# EAGLE design PCB_eLock_G592_J1_only_actuators (EAGLE 6.6.0)
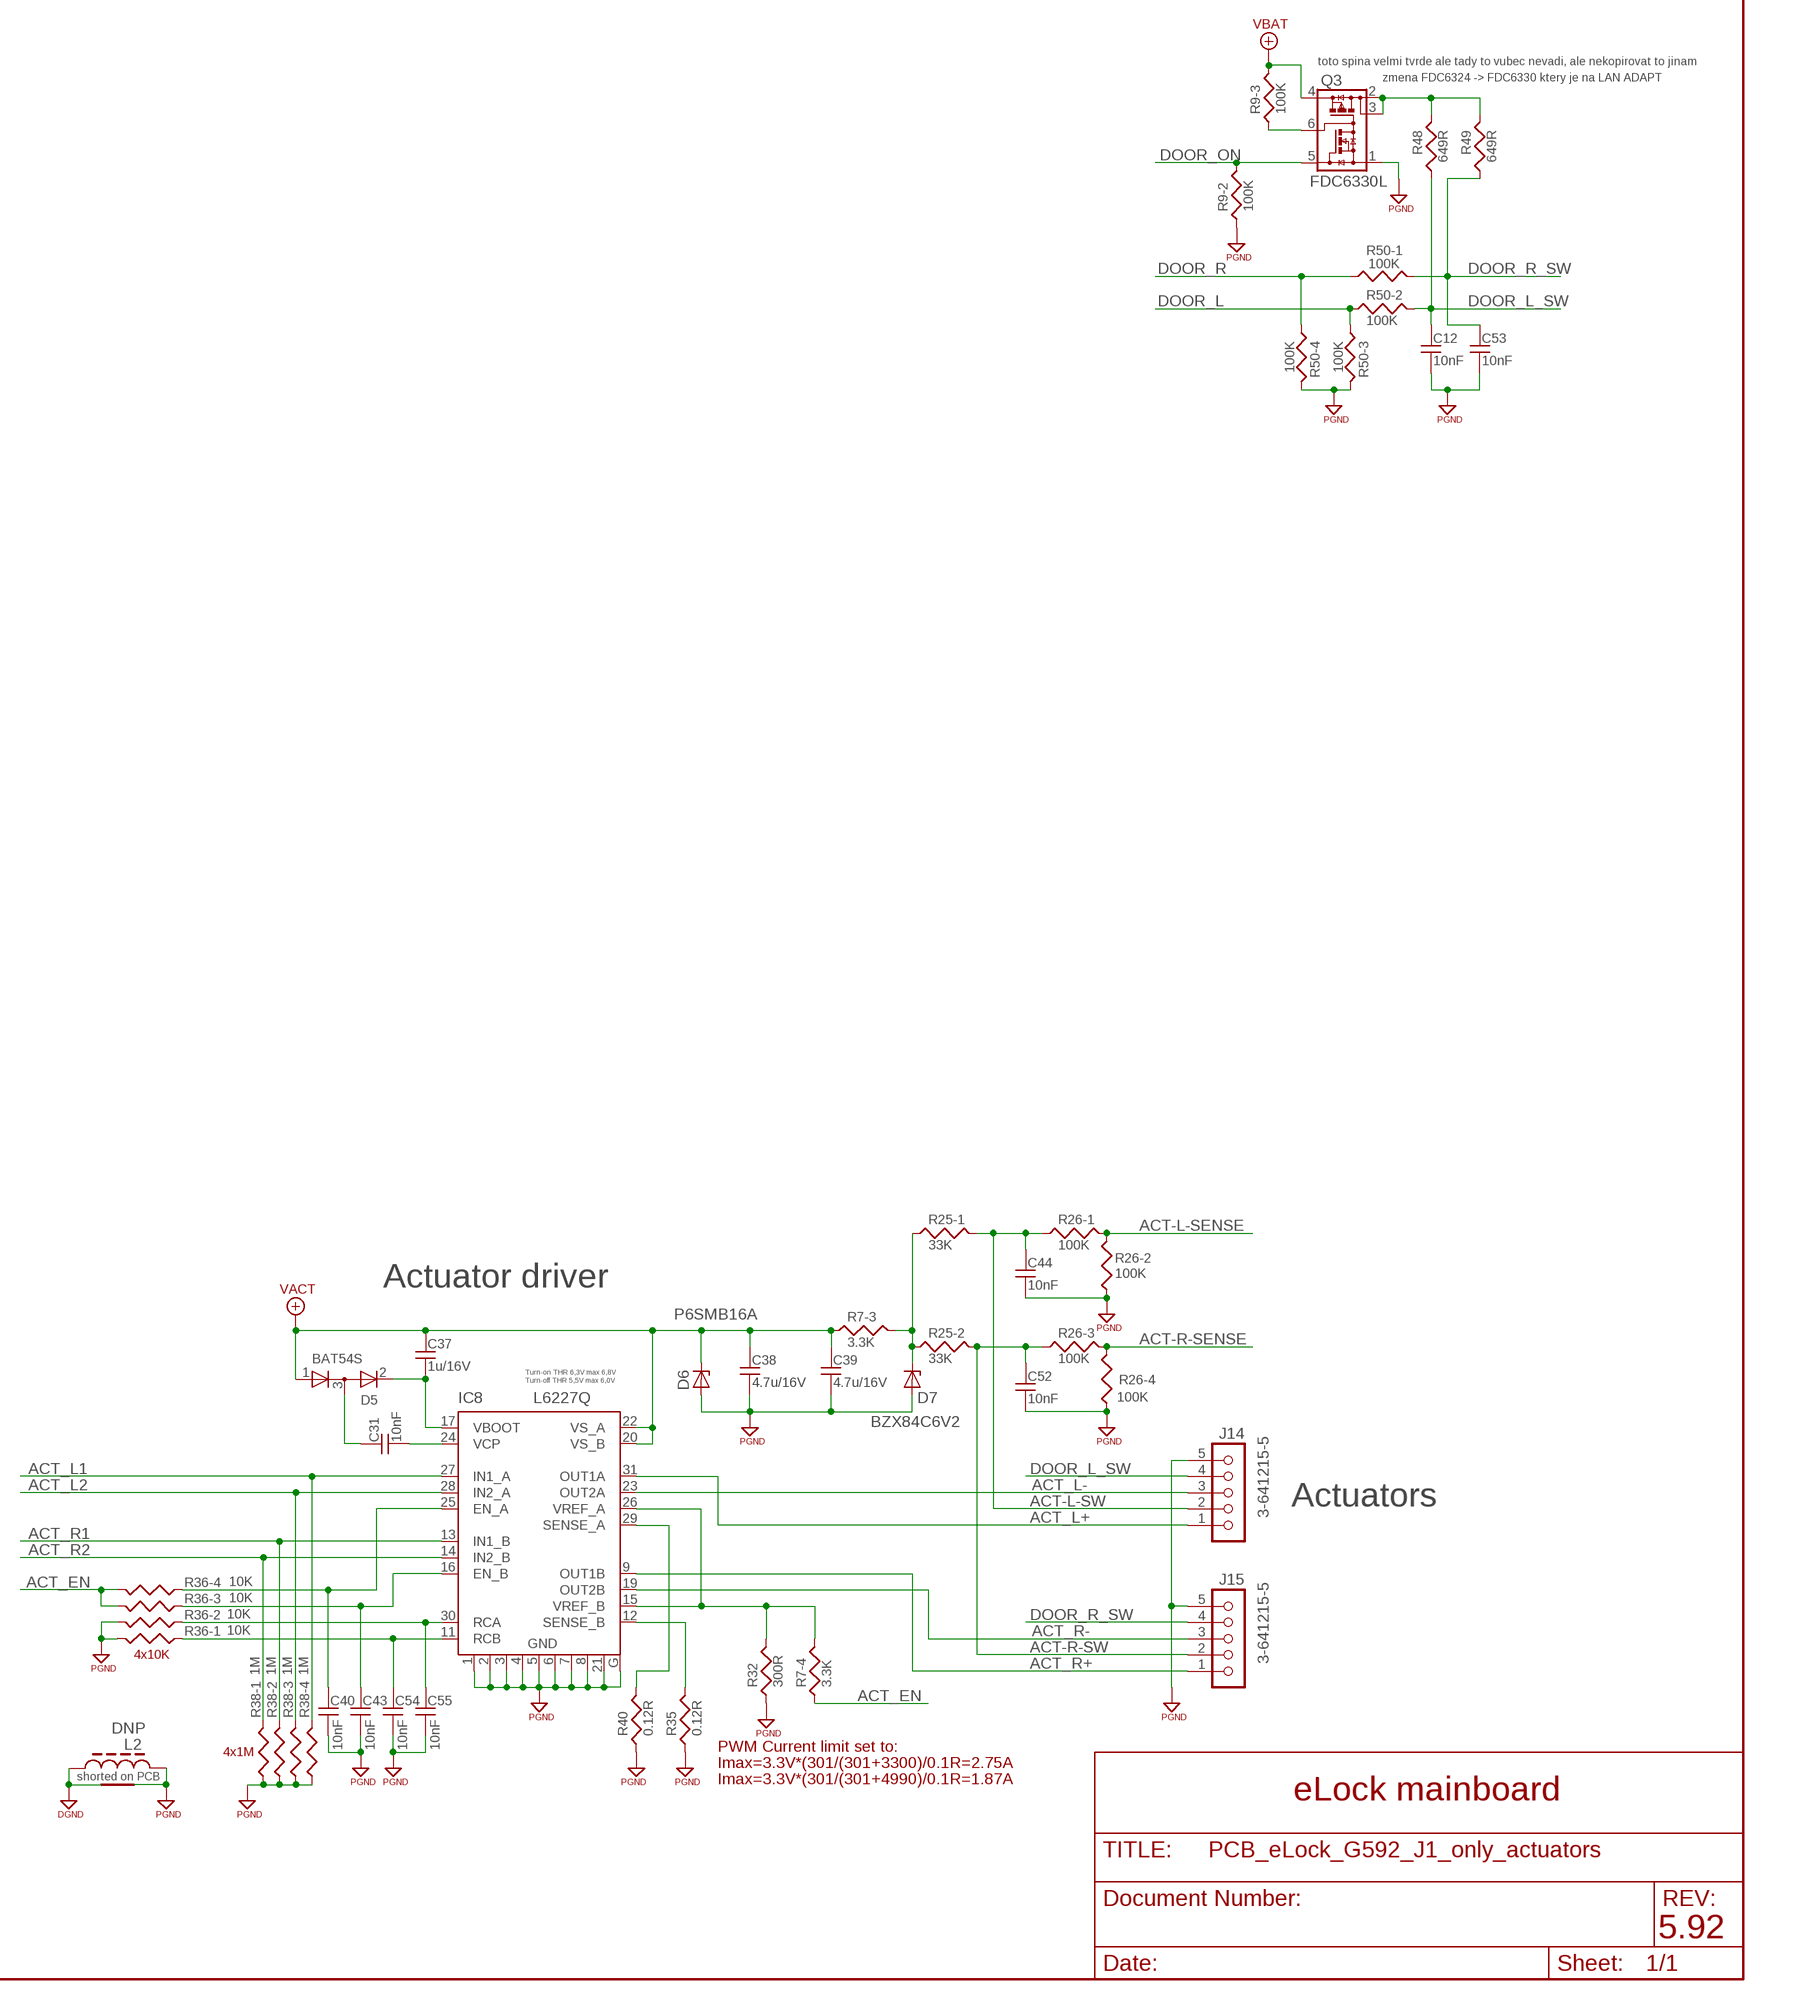
[diagram p0: schematic, sheet 1]

## Parts
C12  10nF  C-0603  [0603]
C31  10nF  C-0603  [0603]
C37  1u/16V  C-0603  [0603]
C38  4.7u/16V  C-0805  [0805]
C39  4.7u/16V  C-0805  [0805]
C40  10nF  C-0603  [0603]
C43  10nF  C-0603  [0603]
C44  10nF  C-0603  [0603]
C52  10nF  C-0603  [0603]
C53  10nF  C-0603  [0603]
C54  10nF  C-0603  [0603]
C55  10nF  C-0603  [0603]
D5  BAT54S  [SOT-23]
D6  P6SMB16A  [SMB]
D7  BZX84C6V2  [SOT-23]
IC8  L6227Q  [SQFP-S-5X5-32]
J14  3-641215-5  [3-641215-5]
J15  3-641215-5  [3-641215-5]
L2  DNP  L-0805-0R  [0805-0RTOP]
Q3  FDC6330L  FDC6324L  [SSOT-6]
R7  3.3K  EXB-38  [0603-ARRAY]
R9  100K  EXB-38  [0603-ARRAY]
R25  33K  EXB-38  [0603-ARRAY]
R26  100K  EXB-38  [0603-ARRAY]
R32  300R  R-0603  [0603]
R35  0.12R  R-0805  [0805]
R36  10K  EXB-38  [0603-ARRAY]
R38  1M  EXB-38  [0603-ARRAY]
R40  0.12R  R-0805  [0805]
R48  649R  R-0603  [0603]
R49  649R  R-0603  [0603]
R50  100K  EXB-38  [0603-ARRAY]

## Nets
ACT-L-SENSE: R26.7 R26.8
ACT-L-SW: C44.1 J14.2 R25.8 R26.1
ACT-R-SENSE: R26.5 R26.6
ACT-R-SW: C52.1 J15.2 R25.7 R26.3
ACT_EN: R7.4 R36.5 R36.6
ACT_L1: IC8.27(IN1_A) R38.5
ACT_L2: IC8.28(IN2_A) R38.6
ACT_L+: IC8.31(OUT1A) J14.1
ACT_L-: IC8.23(OUT2A) J14.3
ACT_R1: IC8.13(IN1_B) R38.7
ACT_R2: IC8.14(IN2_B) R38.8
ACT_R+: IC8.9(OUT1B) J15.1
ACT_R-: IC8.19(OUT2B) J15.3
DGND: L2.2
DOOR_L: R50.2 R50.3
DOOR_L_SW: C12.1 J14.4 R48.2 R50.7
DOOR_ON: Q3.5(Q1G) R9.7
DOOR_R: R50.1 R50.4
DOOR_R_SW: C53.1 J15.4 R49.2 R50.8
N$6: C31.2 IC8.24(VCP)
N$19: C31.1 D5.3(KA)
N$29: D7.3(C) R7.6 R25.1 R25.2
N$31: IC8.12(SENSE_B) R35.2
N$35: Q3.6(Q2G) R9.3
N$40: Q3.2(Q2D1) Q3.3(Q2D2) R48.1 R49.1
N$41: IC8.29(SENSE_A) R40.2
N$47: C37.2 D5.2(K) IC8.17(VBOOT)
N$51: C54.1 IC8.11(RCB) R36.1
N$60: C40.1 IC8.25(EN_A) R36.4
N$70: C43.1 IC8.16(EN_B) R36.3
N$71: C55.1 IC8.30(RCA) R36.2
N$78: IC8.15(VREF_B) IC8.26(VREF_A) R7.5 R32.2
PGND: C12.2 C38.2 C39.2 C40.2 C43.2 C44.2 C52.2 C53.2 C54.2 C55.2 D6.A D7.1(A) IC8.1(GND1) IC8.2(GND2) IC8.3(GND3) IC8.4(GND4) IC8.5(GND5) IC8.6(GND6) IC8.7(GND7) IC8.8(GND8) IC8.21(GND21) IC8.G(GNEXP) J14.5 J15.5 L2.1 Q3.1(Q1S) R9.2 R26.2 R26.4 R32.1 R35.1 R36.7 R36.8 R38.1 R38.2 R38.3 R38.4 R40.1 R50.5 R50.6
VACT: C37.1 C38.1 C39.1 D5.1(A) D6.C IC8.20(VS_B) IC8.22(VS_A) R7.3
VBAT: Q3.4(Q2S) R9.6
Unconnected: R7.1 R7.2 R7.7 R7.8 R9.1 R9.4 R9.5 R9.8 R25.3 R25.4 R25.5 R25.6

## Notes on the sheet
- toto spina velmi tvrde ale tady to vubec nevadi, ale nekopirovat to jinam
- zmena FDC6324 -> FDC6330 ktery je na LAN ADAPT
- Actuator driver
- Turn-on THR 6,3V max 6,8V
- Turn-off THR 5,5V max 6,0V
- Actuators
- 4x10K
- PWM Current limit set to:
- 4x1M
- Imax=3.3V*(301/(301+3300)/0.1R=2.75A
- shorted on PCB
- Imax=3.3V*(301/(301+4990)/0.1R=1.87A
- eLock mainboard
- 5.92

## Library data of the parts
C12 C31 C37 C40 C43 C44 C52-C55 = DISCRETE:C-0603
C38 C39 = DISCRETE:C-0805
D5 = Fairchild-AON:BAT54S: Schottky diode dual 30V 200mA
D6 = Littelfuse:P6SMB*: TVS Unidirectional 13.6V, 15.2-16.8V breakdown
D7 = Fairchild-AON:BZX84C: Diode Zener SOT23
IC8 = st-microelectronics-AOM:L6227: DMOS dual full bridge driver with PWM 2A, 0.7Ohm 52V
J14 J15 = Tyco-U:3-641215-5: Connector 5 pin 100 mil
L2 = DISCRETE:L-0805-0R
Q3 = Fairchild-AON:FDC6324: IC LOAD SWITCH INT 20VIN SSOT-6
R7 R9 R25 R26 R36 R38 R50 = Panasonic-AON:EXB-38: Resistor array 4x
R32 R48 R49 = DISCRETE:R-0603
R35 R40 = DISCRETE:R-0805

## Board
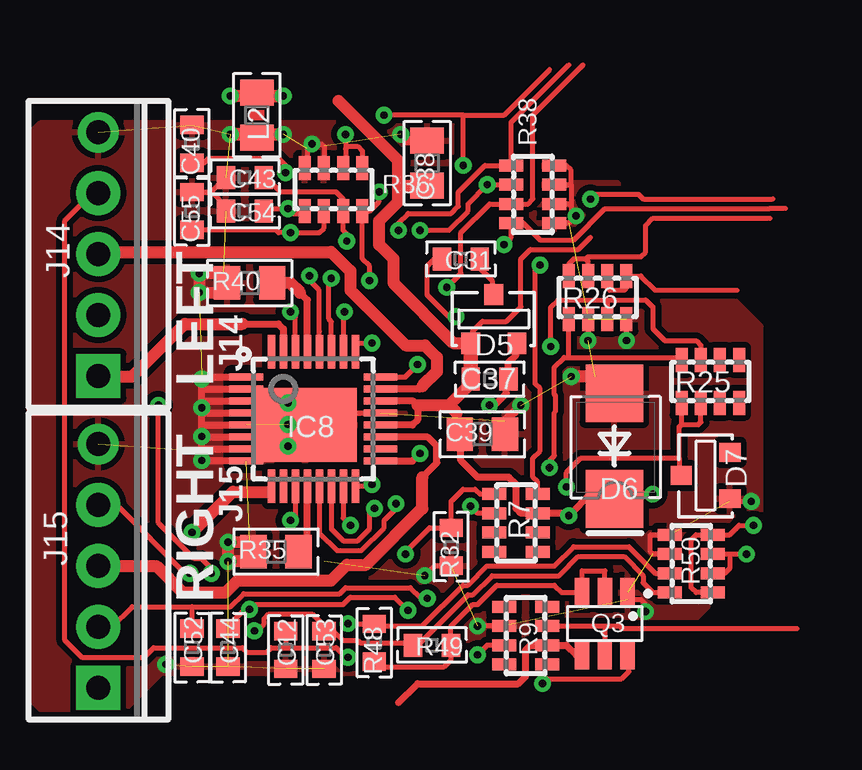
[diagram p1: board, top side]
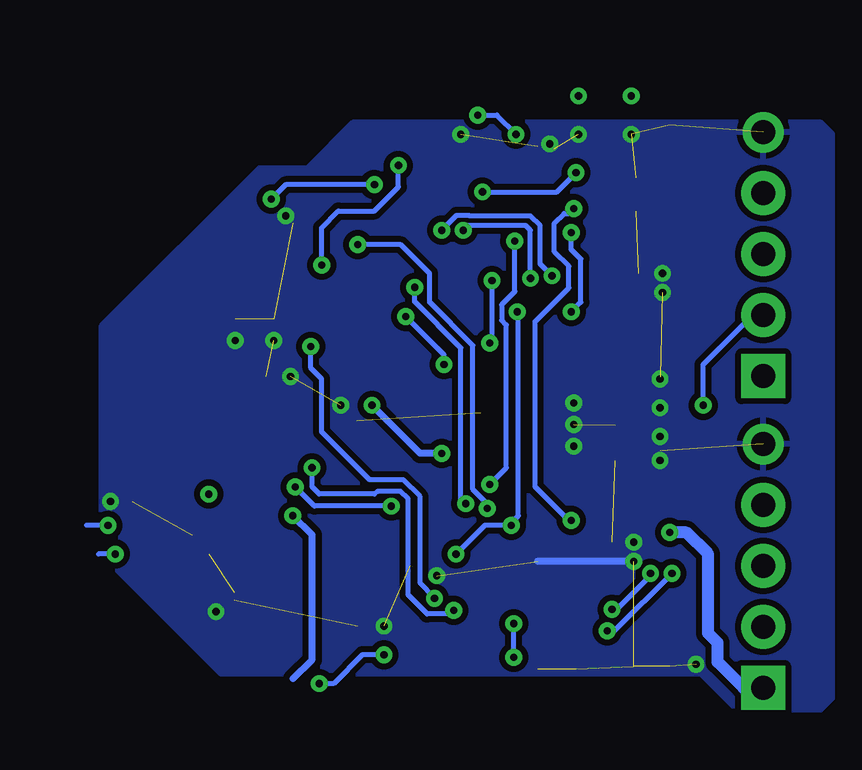
[diagram p2: board, bottom side, seen from below]

No outline drawn. Coordinates in mm, seen from the top.
Copper layers (1+16): Top 0.035mm / dielectric 1.5mm / Bottom 0.035mm
Design rules "default": minimum track width 0.2mm, minimum drill 0.3mm, track to track 0.153mm, track to pad 0.15mm, pad to pad 0.162mm, via to via 0.15mm, smd to smd 0.15mm, copper to edge 5mil, drill to drill 8mil, minimum pad ring 0.2mm, minimum via ring 0.2mm, stop-mask expansion 4mil, vias tented up to drill 0.3mm, thermal gap 10mil
tRestrict: area 10.4,34.6 to 14.2,35.1

### Footprints (pad centres in the part's own frame; a part is rotated, then mirrored left to right if it is on the bottom)
0603 = smd 0.762 x 0.965: 1 -0.787,0; 2 0.787,0
0805 = smd 1.092 x 1.397: 1 -0.94,0; 2 0.94,0
SOT-23 = smd 0.787 x 0.889: 1 0.991,1.016; 2 -0.94,1.016; 3 0.025,-1.016
SMB = smd 2.4 x 2.4: A 2.2,0; C -2.2,0
SQFP-S-5X5-32 = smd 0.3 x 1.4: 1 -1.75,-2.8; 2 -1.25,-2.8; 3 -0.75,-2.8; 4 -0.25,-2.8; 5 0.25,-2.8; 6 0.75,-2.8; 7 1.25,-2.8; 8 1.75,-2.8; 17 1.75,2.8; 18 1.25,2.8; 19 0.75,2.8; 20 0.25,2.8; 21 -0.25,2.8; 22 -0.75,2.8; 23 -1.25,2.8; 24 -1.75,2.8 | smd 1.4 x 0.3: 9 2.8,-1.75; 10 2.8,-1.25; 11 2.8,-0.75; 12 2.8,-0.25; 13 2.8,0.25; 14 2.8,0.75; 15 2.8,1.25; 16 2.8,1.75; 25 -2.8,1.75; 26 -2.8,1.25; 27 -2.8,0.75; 28 -2.8,0.25; 29 -2.8,-0.25; 30 -2.8,-0.75; 31 -2.8,-1.25; 32 -2.8,-1.75 | smd 3.1 x 4.3: G 0.25,-0.35
3-641215-5 = drill 1 pad 1.829 square: 1 5.08,0 | drill 1 pad 1.829: 2 2.54,0; 3 0,0; 4 -2.54,0 | drill 1 pad 1.702: 5 -5.08,0
0805-0RTOP = smd 1.092 x 1.397: 1 -0.94,0; 2 0.94,0
SSOT-6 = smd 0.6 x 1.2: 1 -0.95,-1.306; 2 0,-1.306; 3 0.95,-1.306; 4 0.95,1.306; 5 0.003,1.306; 6 -0.95,1.306
0603-ARRAY = smd 0.5 x 1: 1 -1.2,-0.9; 2 -0.4,-0.9; 3 0.4,-0.9; 4 1.2,-0.9; 5 1.2,0.9; 6 0.4,0.9; 7 -0.4,0.9; 8 -1.2,0.9

### Placement (x,y rotation side)
C12  11.2,23.5 270 top
C31  18.5,39.8 180 top
C37  19.7,34.8 0 top
C38  17.1,43.8 90 top
C39  19.4,32.5 0 top
C40  7.3,44.6 90 top
C43  9.5,43.2 180 top
C44  8.8,23.6 270 top
C52  7.3,23.6 270 top
C53  12.8,23.5 270 top
C54  9.5,41.8 180 top
C55  7.3,41.8 90 top
D5  19.9,37.3 180 top
D6  24.9,32 90 top
D7  28.7,30.8 270 top
IC8  12.36,33.13 270 top
J14  3.4,40 270 top
J15  3.4,27 270 top
L2  10,45.8 90 top
Q3  24.5,24.6 180 top
R7  20.8,28.8 90 top
R9  21.2,24.1 270 top
R25  28.9,34.7 0 top
R26  24.2,38.2 0 top
R32  18.1,27.8 90 top
R35  10.8,27.6 0 top
R36  13.2,42.7 0 top
R38  21.5,42.5 90 top
R40  9.7,38.8 0 top
R48  14.9,23.8 90 top
R49  17.3,23.7 180 top
R50  28.1,27.1 90 top

### Tracks (layer width: path | path; a pad name or v marks a point on that pad's centre or on a via)
ACT-L-SENSE
  Top 0.2: R26.8 23,39.6 23.2,39.8 23.7,39.8 | 23.7,39.8 23.8,39.9 26,39.9 26.2,40.1 26.2,41.2 26.5,41.5 31.38,41.5 | R26.7 23.8,39.7 23.7,39.8
ACT-L-SW  (via drill 0.3 pad 0.7)
  Top 0.2: v5.9,33.7 5.9,28.8 7.4,27.3 7.7,27.3 8.1,26.9 v8.1,26.7 | R25.8 27.6,35.7 23,35.7 | 23,35.7 R26.1 | 23,35.7 22.8,35.7 22.4,35.3 22.4,34.15 22.45,34.1 22.45,33.45 22.4,33.4 22.4,31.6 22.2,31.4 v22.2,31.1 | v16.3,25.15 15.75,25.7 13.9,25.7 13.6,25.4 9.9,25.4 v9.7,25.2 9.5,25.2 8.8,24.5 C44.1
  Bottom 0.2: J14.2 3.84,37.46 5.9,35.4 v5.9,33.7 | v9.7,25.2 9.5,25.2 8.1,26.6 v8.1,26.7 | v22.2,31.1 22.2,30.3 21.9,30 19.6,30 19.5,30.1 19.48,30.1 19.46,30.12 18.52,30.12 18.2,29.8 18.2,25.8 17.4,25 16.45,25 v16.3,25.15
ACT-R-SENSE
  Top 0.2: R26.6 24.6,38.6 24.7,38.5 25.3,38.5 25.4,38.6 R26.5 26,39.1 26.6,38.5 30,38.5
ACT-R-SW  (via drill 0.3 pad 0.7)
  Top 0.2: J15.2 3.96,24.46 4.8,25.3 7.3,25.3 | 24.6,38.1 26.2,38.1 26.5,37.8 26.5,36.9 27,36.4 28.3,36.4 28.5,36.2 R25.7 | 24.6,38.1 R26.3 | 24.6,38.1 22.55,38.1 22.25,37.8 v22.25,36.15 | 7.3,25.3 8.9,25.3 9.45,25.85 13.45,25.85 13.7,26.1 16.4,26.1 16.8,25.7 17.05,25.7 v17.1,25.65 | C52.1 7.3,25.3
  Bottom 0.2: v22.25,36.15 22.25,35.25 21.8,34.8 21.8,32.6 19.8,30.6 18.4,30.6 17.7,29.9 17.7,26.3 17.1,25.7 v17.1,25.65
ACT_EN  (via drill 0.3 pad 0.7)
  Top 0.2: 22.2,47.7 20.3,45.8 18.6,45.8 | 18.6,45.8 v15.3,45.8 | 13.7,44.4 13.7,43.7 R36.6 | v13.7,45 13.7,44.4 | R36.5 14.4,44.3 14.2,44.5 13.8,44.5 13.7,44.4 | v21.8,39.55 21.6,39.35 21.6,34.6 21.8,34.4 21.8,31.8 21.5,31.5 21.5,30.7 21.7,30.5 R7.4 | v18.6,43.7 18.6,45.8
  Bottom 0.2: v15.3,45.8 14.5,45.8 v13.7,45 | v21.8,39.55 21.8,41.1 21.1,41.8 19.6,41.8 18.6,42.8 v18.6,43.7
ACT_L1  (via drill 0.3 pad 0.7)
  Top 0.2: IC8.27 13.11,37.19 13,37.3 13,38.9 v13.1,39 | v15.9,41 15.9,41.3 16.3,41.7 18.1,41.7 18.4,42 18.4,42.6 19.5,43.7 R38.5 20.6,45.5 23,47.9
  Bottom 0.2: v13.1,39 13.1,41 13.3,41.2 15.7,41.2 v15.9,41
ACT_L2  (via drill 0.3 pad 0.7)
  Top 0.2: IC8.28 12.61,36.79 12.6,36.8 12.6,38.5 12.2,38.9 v12.2,39.1 | v16.8,41 18,41 18.8,41.8 18.8,42.1 v19.6,42.9 R38.6 | 31.5,42.3 26.1,42.3 25.9,42.5 24.1,42.5 v23.9,42.3
  Bottom 0.2: v12.2,39.1 12.7,39.6 12.7,41.2 13.1,41.6 15.64,41.6 15.66,41.62 16.18,41.62 v16.8,41 | v19.6,42.9 23.3,42.9 v23.9,42.3
ACT_L+
  Top 0.3: IC8.31 11.11,36.89 10.9,37.1 9.4,37.1
  Top 0.5: 9.4,37.1 7,37.1 4.8,34.9 3.42,34.9 J14.1
ACT_L-
  Top 0.3: IC8.23 16.78,34.38 16.9,34.5
  Top 0.5: 16.9,34.5 17.5,35.1 17.5,35.7 17,36.2 16.2,36.2 13.9,38.5 13.9,39.3 13.1,40.1 3.5,40.1 J14.3
ACT_R1  (via drill 0.3 pad 0.7)
  Top 0.2: IC8.13 12.61,28.39 13.35,27.65 14.35,27.65 15.3,28.6 15.3,28.9 15.8,29.4 v15.8,29.6 | v17.92,38.62 18.5,39.2 18.5,40.9 19.7,42.1 R38.7 21.3,42.1 21.5,42.3 21.5,45.8 23.6,47.9
  Bottom 0.2: v15.8,29.6 16,29.8 16,36.1 17.92,38.02 v17.92,38.62
ACT_R2  (via drill 0.3 pad 0.7)
  Top 0.2: IC8.14 13.11,28.54 13.6,28.05 14.2,28.05 14.7,28.55 14.7,29.2 v14.9,29.4 | v20.3,40.4 20.6,40.7 R38.8 21.1,41.3 21.8,40.6 23.2,40.6 24.5,41.9 31.34,41.9 31.36,41.92 32.02,41.92
  Bottom 0.2: v14.9,29.4 14.9,29.6 15.5,30.2 15.5,36.2 17.3,38 17.3,39.2 18.5,40.4 v20.3,40.4
ACT_R+  (via drill 0.3 pad 0.7)
  Top 0.3: 10.5,30.1 10.61,30.1 IC8.9
  Top 0.5: 10.5,30.1 9,30.1 v7.3,28.4
  Bottom 0.5: v7.3,28.4 6.6,28.4 5.7,27.5 5.7,24.2 5.3,23.8 5.3,23 4.22,21.92 J15.1
ACT_R-
  Top 0.3: IC8.19 17.12,32.38 17.5,32 17.5,31.3 16.9,30.7
  Top 0.5: 16.9,30.7 16.9,29.4 14.55,27.05 13.75,27.05 13.1,26.4 9.2,26.4 8.7,25.9 6.9,25.9 5.8,27 J15.3
DGND  (via drill 0.3 pad 0.7)
  Top 0.5: 10.36,46.64 10.34,46.64 10.3,46.6 v11.1,46.6 10.1,46.6 | 10.1,46.6 v8.9,46.6 | L2.2 10.1,46.74 10.1,46.6
DOOR_L  (via drill 0.3 pad 0.7)
  Top 0.2: R50.2 29.5,26.7 29.7,26.9 29.7,27.5 | R50.3 29.7,27.5 | 29.7,27.5 v30.4,27.5
  Bottom 0.2: v30.4,27.5 31.1,27.5
DOOR_L_SW  (via drill 0.3 pad 0.7)
  Top 0.2: J14.4 3.14,42.54 2,41.4 2,23.9 2.7,23.2 5.3,23.2 5.7,23.6 9.4,23.6 9.6,23.4 10.4,23.4 10.6,23.6 11.2,23.6 | R50.7 26.6,26.7 25.5,27.8 23.2,27.8 22.4,27 19.6,27 18.8,26.2 18.6,26.2 16.9,24.5 14.99,24.5 R48.2 14.89,24.6 v13.8,24.6 | 11.2,23.6 13.3,23.6 13.7,23.2 v13.8,23.2 | C12.1 11.2,23.6
  Bottom 0.2: v13.8,23.2 v13.8,24.6
DOOR_ON
  Top 0.2: R9.7 24.5,24.5 | 24.5,24.5 Q3.5 | 24.5,24.5 25.1,24.5 25.2,24.4 32.5,24.4
DOOR_R  (via drill 0.3 pad 0.7)
  Top 0.2: R50.1 28.3,25.9 28.1,26.1 28.1,28.1 28.3,28.3 R50.4 29.7,28.3 30.1,28.7 v30.7,28.7
  Bottom 0.2: v30.7,28.7 31.6,28.7
DOOR_R_SW  (via drill 0.3 pad 0.7)
  Top 0.2: J15.4 4.16,29.54 7,26.7 v7.2,26.7 | R50.8 26.5,25.9 26.1,26.3 26.1,26.6 25.3,27.4 23.4,27.4 22.6,26.6 19.8,26.6 19,25.8 18.8,25.8 16.7,23.7 R49.2 16.41,23.8 14.3,23.8 14.2,23.9 13.6,23.9 13.21,24.29 C53.1 12.8,24.5 12.3,25 10.5,25 10.3,24.8 10.3,24.6 10,24.3 v9.9,24.3
  Bottom 0.2: v7.2,26.7 9.6,24.3 v9.9,24.3
N$6  (via drill 0.3 pad 0.7)
  Top 0.2: IC8.24 16.18,34.88 v16.7,35.4 | v18.3,37.4 18,37.4 17.1,38.3 17.1,39.5 17.4,39.8 C31.2
  Bottom 0.2: v16.7,35.4 16.7,35.8 v18.3,37.4
N$19
  Top 0.2: C31.1 19.29,39.41 19.8,38.9 19.8,38.39 D5.3
N$29  (via drill 0.3 pad 0.7)
  Top 0.2: R7.6 19.2,29.2 v18.9,29.5 | v22.9,30.3 22.9,30.9 23.5,31.5 27.6,31.5 | 27.6,31.5 27.6,30.86 D7.3 | R25.2 28.5,33 28.4,32.9 27.7,32.9 | 27.7,32.9 27.6,32.8 27.6,31.5 | 27.7,32.9 R25.1
  Bottom 0.2: v18.9,29.5 22.1,29.5 v22.9,30.3
N$31
  Top 0.3: IC8.12 12.11,27.71 12,27.6 R35.2
N$35  (via drill 0.3 pad 0.7)
  Top 0.2: R9.3 19.6,23.7 v19.2,23.3 | v21.9,22.1 22.1,22.3 25.2,22.3 25.5,22.6 25.5,23.24 Q3.6
  Bottom 0.2: v19.2,23.3 20.1,23.3 21.3,22.1 v21.9,22.1
N$40
  Top 0.2: R48.1 15.1,22.8 17.8,22.8 18.1,23.1 18.1,23.69 R49.1 18.09,24.49 19,25.4 19.2,25.4 20,26.2 22.4,26.2 22.7,25.9 Q3.3 23.55,26.8 24.5,26.8 Q3.2
N$41
  Top 0.3: IC8.29 12.11,38.09 11.8,38.4
  Top 0.5: 11.8,38.4 11.4,38.8 R40.2
N$47  (via drill 0.3 pad 0.7)
  Top 0.3: IC8.17 16.48,31.38 v16.8,31.7 | v19.7,33.7 19.9,33.7 20.4,34.2 20.4,34.71 C37.2 20.49,35.49 20.8,35.8 20.8,36.24 D5.2
  Bottom 0.3: v16.8,31.7 17.7,31.7 v19.7,33.7
N$51  (via drill 0.3 pad 0.7)
  Top 0.2: IC8.11 11.61,29.11 v11.4,28.9 | R36.1 11.9,41.7 11.5,41.7 v11.3,41.9 10.6,41.9 10.5,41.8 C54.1
  Bottom 0.2: v11.4,28.9 11.5,28.9 12.9,30.3 12.9,37.2 11.5,38.6 11.5,39.5 12.1,40.1 12.1,41.3 11.7,41.7 11.5,41.7 v11.3,41.9
N$60  (via drill 0.3 pad 0.7)
  Top 0.2: IC8.25 14.11,36.29 14.1,36.3 v14.8,36.3 | v14.7,38.9 14.7,39.5 14.4,39.8 R36.4 14.7,41.8 15.1,42.2 v15.1,42.6 | C40.1 7.81,43.81 8,44 10.9,44 11.2,43.7 v11.2,43.4
  Bottom 0.2: v14.8,36.3 14.7,36.4 v14.7,38.9 | v15.1,42.6 12,42.6 v11.2,43.4
N$70  (via drill 0.3 pad 0.7)
  Top 0.2: IC8.16 14.73,30.33 v14.8,30.4 | v13.75,40.55 13.75,40.85 13.6,41 R36.3 13.6,42.3 13.3,42.6 11,42.6 10.4,43.2 C43.1
  Bottom 0.2: v14.8,30.4 14.1,31.1 14.1,37.05 14.3,37.25 14.3,37.9 13.75,38.45 v13.75,40.55
N$71  (via drill 0.3 pad 0.7)
  Top 0.2: IC8.30 11.61,37.39 v11.4,37.6 | R36.2 12.8,41.1 12.6,40.9 v11.4,40.9 10.9,40.9 10.8,41 7.31,41 C55.1
  Bottom 0.2: v11.4,37.6 11,38 11,39.8 11.4,40.2 v11.4,40.9
N$78  (via drill 0.3 pad 0.7)
  Top 0.2: IC8.26 13.61,37.59 13.62,37.6 v13.65,37.6 | v13.9,28.7 13.6,29 IC8.15 | R7.5 19.3,30 19.1,30.2 18.6,30.2 18.1,29.7 18.1,28.7 18.2,28.6 | v16.2,27.5 16.2,27.6 17.2,28.6 R32.2 | R32.2 18.2,28.6 | 18.2,28.6 18.29,28.6 | R32.2
  Bottom 0.2: v13.65,37.6 13.6,37.55 13.6,29.1 13.9,28.8 v13.9,28.7 15,28.7 v16.2,27.5
PGND  (via drill 0.3 pad 0.7)  (25 unrouted)
  Top 0.2: IC8.4 IC8.21 | R36.7 12.8,44.5 12.7,44.6 v12.3,44.6 12.1,44.4 12.1,43.9 12,43.9 R36.8 | R38.4 22.9,43.7 23.1,43.5 23.1,42.9 | 23.1,42.9 23.1,42 | 23.1,42 23.1,41.6 | R38.1 23,41.3 23.1,41.4 23.1,41.6 | R38.3 23.1,42.9 | R38.2 23,42.1 23.1,42 | 23.1,41.6 v23.3,41.6 | R26.2 v23.8,36.4 | R26.4 v25.4,36.4 | D7.1 29.72,29.72 29.7,29.7 v30.6,29.7 | v26.2,25.1 26.2,25.4 26,25.6 25.45,25.6 Q3.1 | C55.2 8.09,42.59 | R32.1 17.41,27.01 v17,26.6 | R9.2 v19.2,24.5 | v11.3,32.9 11.32,32.88 IC8.G | v11.3,33.8 v11.3,32.9 | v11.3,32.9 v11.3,32 | 8.09,42.59 8.11,42.59 8.71,41.99 C54.2 | 8.09,42.59 C43.2 | R50.6 26.5,27.5 26.4,27.6 26.4,28.3 R50.5
  Top 0.3: IC8.1 7.7,34.88 v7.7,34.8 7.7,34.4 | IC8.8 7.72,31.38 v7.7,31.4 7.7,31.8 | IC8.7 7.78,31.88 7.7,31.8 | 7.7,31.8 v7.7,32.4 | v7.7,32.4 7.7,32.9 | 7.7,32.9 7.7,33.3 | 7.7,33.3 v7.7,33.6 7.7,33.9 | 7.7,33.9 7.7,34.4 | IC8.2 7.72,34.38 7.7,34.4 | IC8.3 7.72,33.88 7.7,33.9 | IC8.4 7.78,33.38 7.7,33.3 | IC8.5 7.72,32.88 7.7,32.9 | IC8.6 7.72,32.38 v7.7,32.4
  Top 0.4: C38.2 16.26,44.74 v16,45 | C39.2 20.34,33.04 v21,33.7
  Top 0.5: R40.1 8.76,39.04 8.6,39.2 v7.6,39.2 v7.6,38.4 8.8,38.4 8.8,38.8 | R35.1 9.86,27.36 9.7,27.2 v8.8,27.2 v8.8,28 9.7,28 9.8,27.9 | D6.A 24.8,34.2 24.1,34.9 v23.1,34.9 | L2.1 10,44.8 9.8,45 v8.9,45 v11.1,45
  Bottom 0.3: v8.8,27.2 12.8,27.2
  other vias: 6.2,22.9
  pour Bottom (isolate 0.254): 1,45.5 20.5,45.5 22.4,43.6 24.4,43.6 31,37 31,27.5 26,22.5 6,22.5 4.5,21 1,21 0.5,21.5 0.5,45
  pour Top (isolate 0.254): 1,45.5 20.5,45.5 23,43 25,43 31,37 31,27.5 26,22.5 6,22.5 4.5,21 1,21 0.5,21.5 0.5,45
VACT  (via drill 0.3 pad 0.7)
  Top 0.2: 23.9,40.7 23.4,40.2 21.4,40.2 21,39.8 21,37.8 20.4,37.2 19.4,37.2 19,36.8 19,36.38 D5.1
  Top 0.3: IC8.22 16.52,33.88 16.7,33.7 16.7,33.1 16.48,32.88 IC8.20 | 18.5,32.47 18.5,31.4 19.2,30.7 20.5,30.7 20.8,30.4 20.8,29.4 21,29.2 R7.3 23,29.2 | 23,29.2 23.1,29.2 23.9,30 24.7,30 | 24.7,30 D6.C | 24.7,30 v26.5,30 | v23,29.1 23,29.2
  Top 0.4: 18.33,33.37 18.33,32.63 C39.1 18.49,32.47 18.5,32.47
  Top 0.5: 18.33,33.37 18,33.7 | 18,33.7 16.7,33.7 | 18,33.7 18.91,34.61 C37.1 18.9,34.81 | D5.1 18.22,36.28 15.7,38.8 15.7,39.8 15.1,40.4 15.1,41.4 15.9,42.2 15.9,42.86 | 15.9,42.86 15.9,43.9 13.4,46.4 | 15.9,42.86 C38.1
  Top 0.6: C37.1 D5.1
  Bottom 0.3: 23,22.3 22.2,23.1 22.2,28.3 v23,29.1
VBAT
  Top 0.2: 23.31,23.29 Q3.4
  Top 0.3: 15.9,21.3 16.7,22.1 20.9,22.1 21.2,22.4 21.2,23.5 21.4,23.7 R9.6 22.9,23.7 23.31,23.29

### Text on the board
tPlace: J14 | LEFT | J15 | RIGHT
Document: Left | Actuators | Right